# EAGLE design SmashBall (EAGLE 9.6.2)
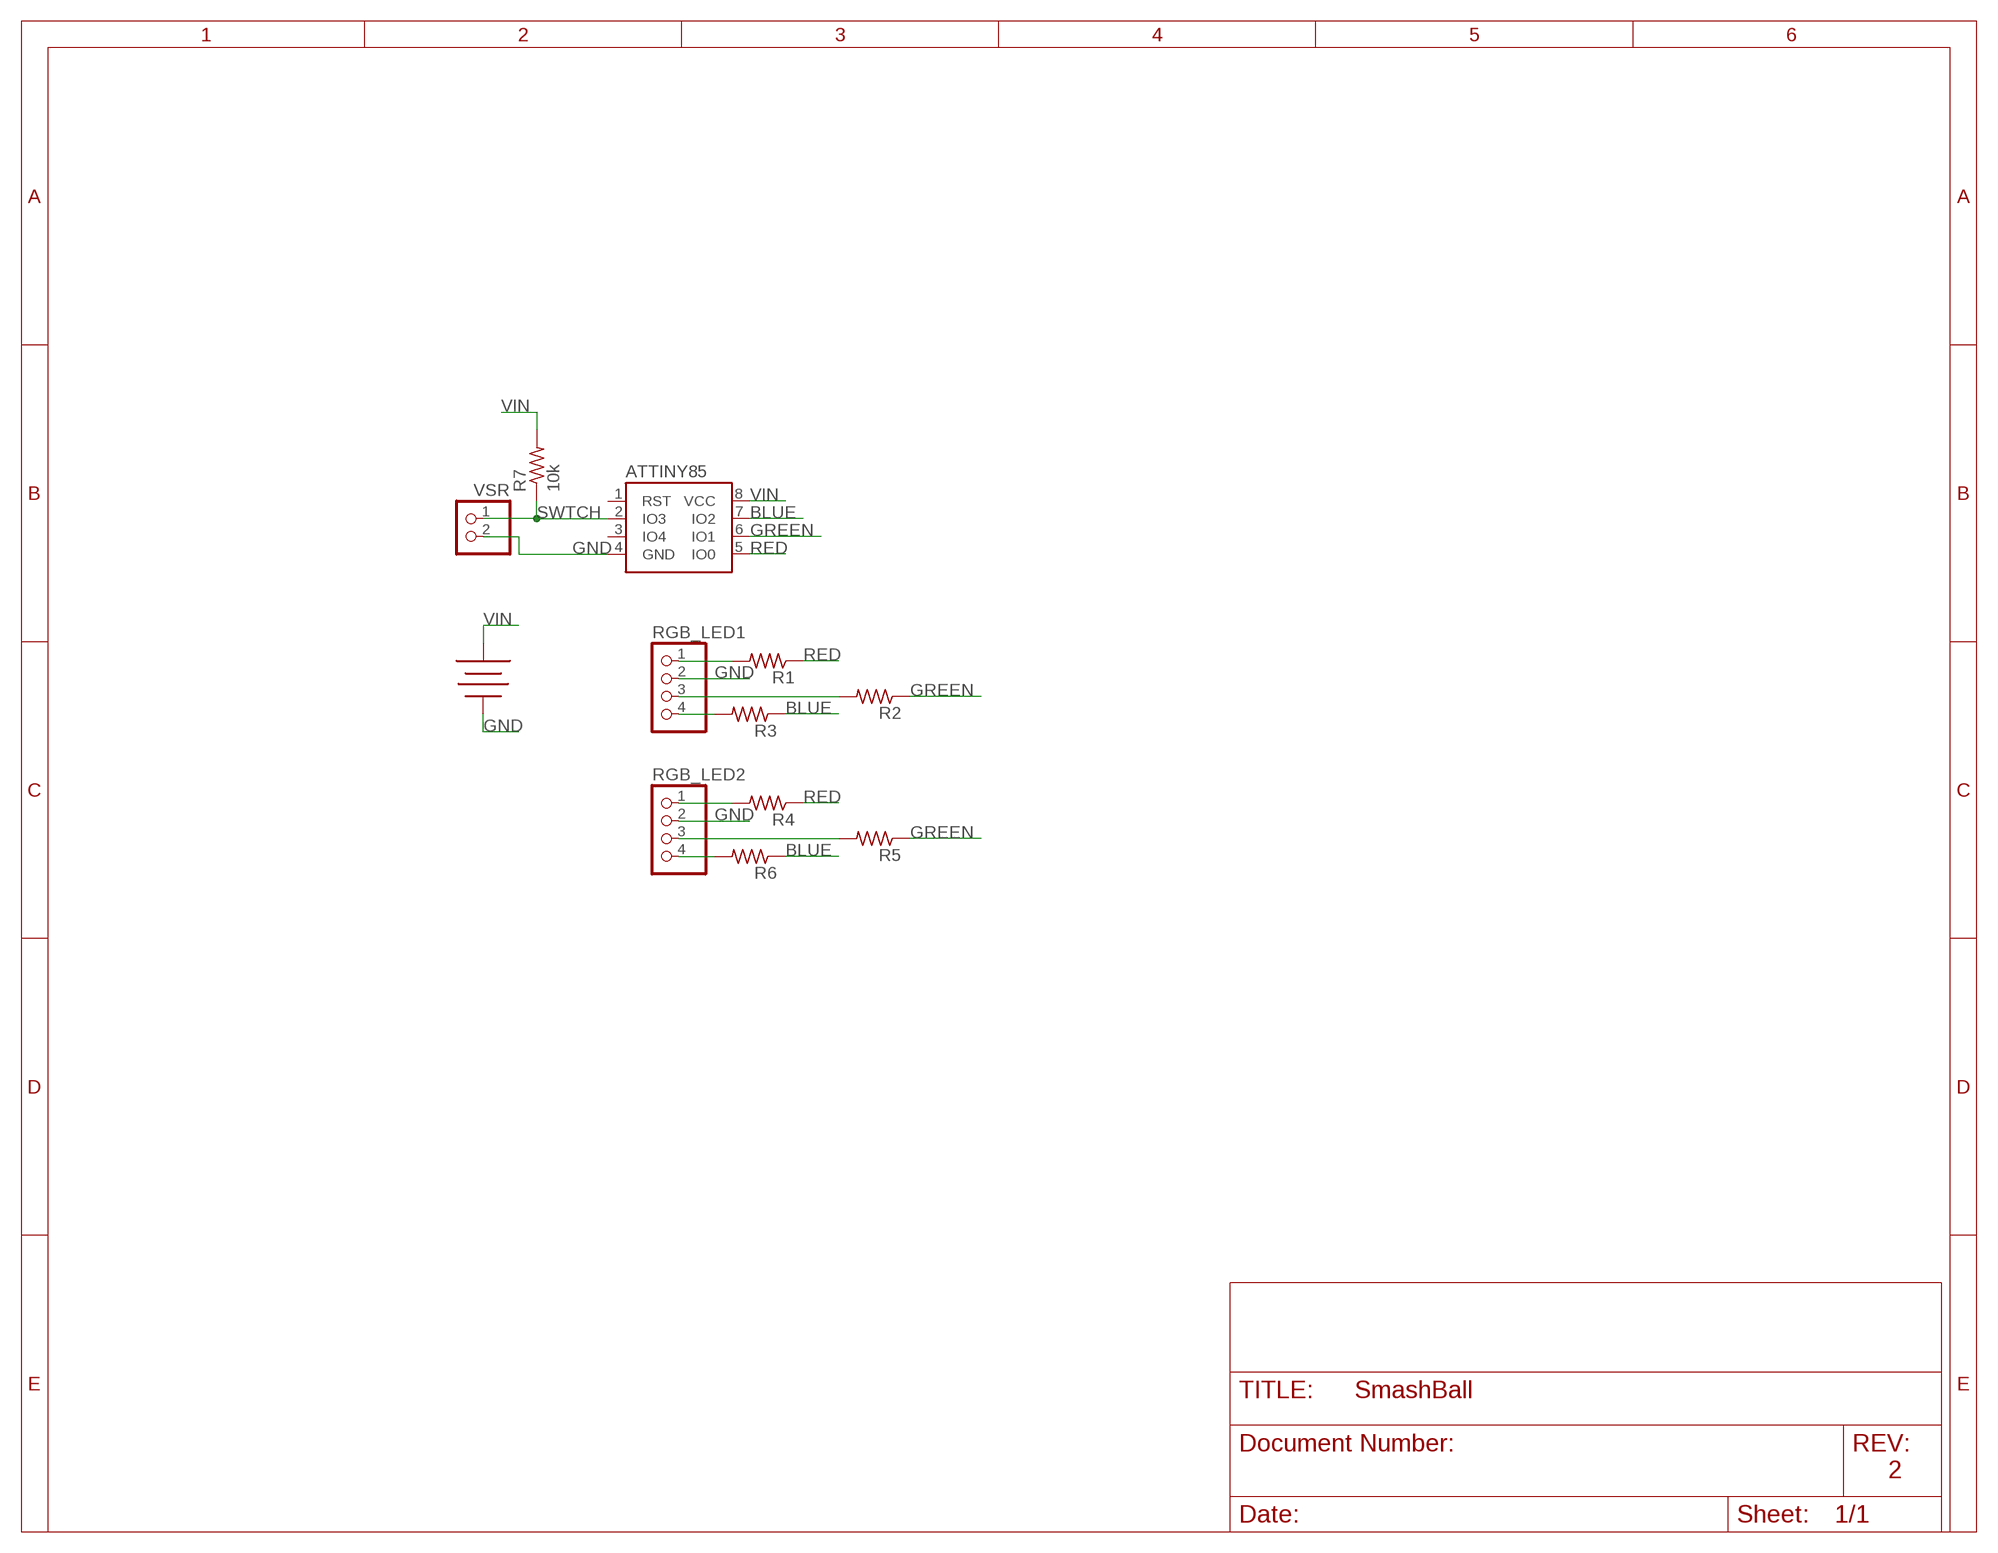
[diagram p0: schematic, sheet 1]

## Parts
R1  R-US_0207/2V  [0207/2V]
R2  R-US_0207/2V  [0207/2V]
R3  R-US_0207/2V  [0207/2V]
R4  R-US_0207/2V  [0207/2V]
R5  R-US_0207/2V  [0207/2V]
R6  R-US_0207/2V  [0207/2V]
R7  10k  R-US_0207/2V  [0207/2V]
RGB_LED1  PINHD-1X4  [1X04]
RGB_LED2  PINHD-1X4  [1X04]
U$1  ATTINY85  [DIP762W53P254L950H370Q8B]
U$2  2032-BATTERY  [2032-BATT]
VSR  PINHD-1X2  [1X02]

## Nets
BLUE: R3.1 R6.1 U$1.7(IO2)
BLUE1: R3.2 RGB_LED1.4
BLUE2: R6.2 RGB_LED2.4
GND: RGB_LED1.2 RGB_LED2.2 U$1.4(GND) U$2.GND VSR.2
GREEN: R2.1 R5.1 U$1.6(IO1)
GREEN1: R2.2 RGB_LED1.3
GREEN2: R5.2 RGB_LED2.3
RED: R1.1 R4.1 U$1.5(IO0)
RED1: R1.2 RGB_LED1.1
RED2: R4.2 RGB_LED2.1
SWTCH: R7.1 U$1.2(IO3) VSR.1
VIN: R7.2 U$1.8(VCC) U$2.VCC
Unconnected: U$1.1(RST) U$1.3(IO4)

## Notes on the sheet
- 2

## Library data of the parts
R1-R7 = rcl:R-US_: RESISTOR, American symbol; SPICEPREFIX: R
RGB_LED1 RGB_LED2 = pinhead:PINHD-1X4: PIN HEADER
U$1 = ShopParts:ATTINY85
U$2 = ShopParts:2032-BATTERY
VSR = pinhead:PINHD-1X2: PIN HEADER

## Board
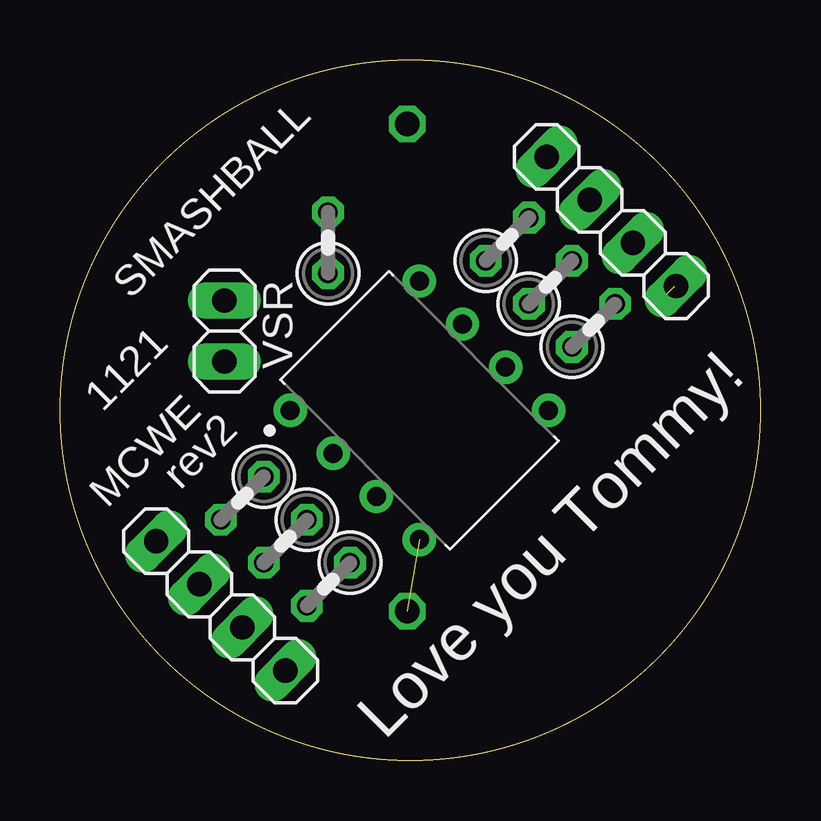
[diagram p1: board, top side]
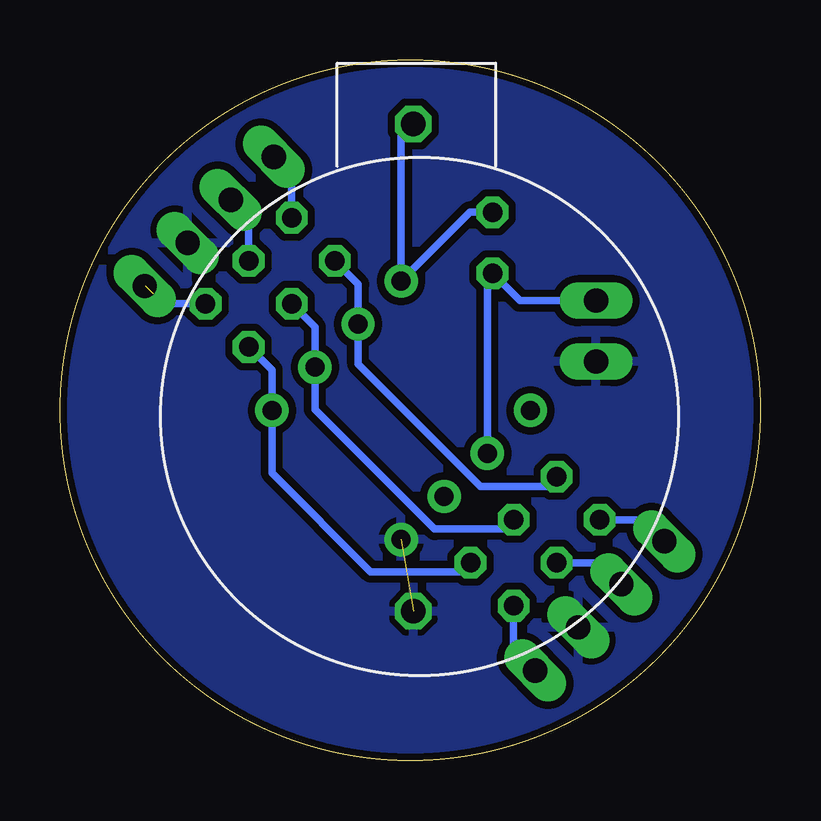
[diagram p2: board, bottom side, seen from below]

Size 29.21 x 29.21 mm. Coordinates in mm from the lower left corner, seen from the top.
Outline: circle at 14.61,14.61 radius 14.61
Copper layers (1*16): Top 0.035mm / dielectric 1.5mm / Bottom 0.035mm
Design rules "ELC_DRC": minimum track width 12mil, minimum drill 0.3mm, track to track 12mil, track to pad 12mil, pad to pad 12mil, via to via 12mil, smd to smd 6mil, copper to edge 12mil, drill to drill 12mil, minimum pad ring 10mil, minimum via ring 8mil, stop-mask expansion 4mil, vias tented up to drill 0mil, thermal gap 10mil

### Footprints (pad centres in the part's own frame; a part is rotated, then mirrored left to right if it is on the bottom)
0207/2V = drill 0.813 octagon: 1 -1.27,0; 2 1.27,0
1X04 = drill 1.016 long: 1 -3.81,0; 2 -1.27,0; 3 1.27,0; 4 3.81,0
DIP762W53P254L950H370Q8B = drill 0.79 pad 1.39: 1 -3.81,3.81; 2 -3.81,1.27; 3 -3.81,-1.27; 4 -3.81,-3.81; 5 3.81,-3.81; 6 3.81,-1.27; 7 3.81,1.27; 8 3.81,3.81
2032-BATT = drill 1.016 octagon: GND 0,0; VCC 0,20.32
1X02 = drill 1.016 long: 1 -1.27,0; 2 1.27,0

### Placement (x,y rotation side)
R1  22.24,18.14 45 top
R2  20.45,19.94 45 top
R3  18.65,21.74 45 top
R4  11.19,7.35 225 top
R5  9.4,9.14 225 top
R6  7.6,10.94 225 top
R7  11.18,21.59 90 top
RGB_LED1  22.99,22.48 135 top
RGB_LED2  6.7,6.45 135 top
U$1  14.99,14.61 45 top
U$2  14.48,6.22 0 bottom
VSR  6.86,17.91 270 top

### Tracks (layer width: path | path; a pad name or v marks a point on that pad's centre or on a via)
BLUE
  Bottom 0.305: R3.1 16.78,19.87 U$1.7 16.78,16.53 11.68,11.43 8.91,11.43 R6.1
BLUE1
  Bottom 0.305: R3.2 19.55,24.43 RGB_LED1.4
BLUE2
  Bottom 0.305: RGB_LED2.4 4.91,10.04 R6.2
GND  (1 unrouted)
  pour Bottom: -2.03,31.62 30.99,31.62 30.99,-2.67 -2.03,-2.67
GREEN
  Bottom 0.305: R2.1 18.58,18.07 U$1.6 18.58,14.64 13.59,9.65 10.69,9.65 R5.1
GREEN1
  Bottom 0.305: R2.2 21.34,22.63 RGB_LED1.3
GREEN2
  Bottom 0.305: RGB_LED2.3 6.7,8.25 R5.2
RED
  Bottom 0.305: R1.1 20.37,16.27 U$1.5 20.37,11.99 16.26,7.87 12.46,7.87 R4.1
RED1  (1 unrouted)
  Bottom 0.305: R1.2 23.15,19.05 24.89,19.05 25.3,19.46 | 25.63,19.79 RGB_LED1.1
RED2
  Bottom 0.305: RGB_LED2.1 10.3,4.65 R4.2
SWTCH
  Bottom 0.305: U$1.2 11.39,20.1 R7.1 10.03,19.18 VSR.1
VIN
  Bottom 0.305: U$2.VCC 14.99,26.04 U$1.8 12.12,22.86 R7.2

### Text on the board
tPlace: SMASHBALL | Love you Tommy! | MCWE | 1121 | rev2